# EAGLE design led-er-v2.3b (EAGLE 7.2.0)
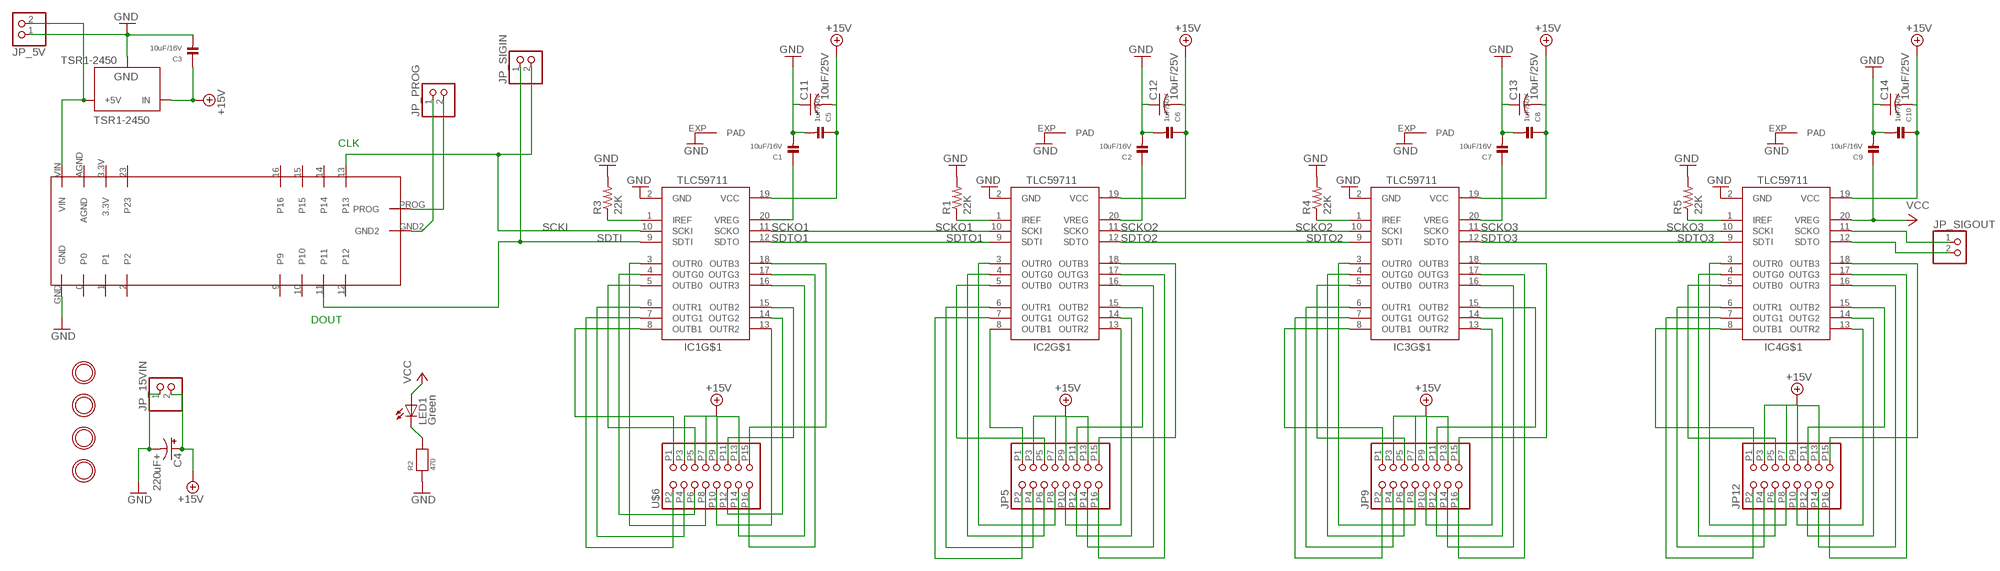
[diagram p0: schematic, sheet 1]

## Parts
C1  10uF/16V  CAP_CERAMIC0805  [0805]
C2  10uF/16V  CAP_CERAMIC0805  [0805]
C3  10uF/16V  CAP_CERAMIC0805  [0805]
C4  220uF+  CPOL-USE5-8.5  [E5-8,5]
C5  1uF/50V  CAP_CERAMIC0805  [0805]
C6  1uF/50V  CAP_CERAMIC0805  [0805]
C7  10uF/16V  CAP_CERAMIC0805  [0805]
C8  1uF/50V  CAP_CERAMIC0805  [0805]
C9  10uF/16V  CAP_CERAMIC0805  [0805]
C10  1uF/50V  CAP_CERAMIC0805  [0805]
C11  10uF/25V  C-USC0805  [C0805]
C12  10uF/25V  C-USC0805  [C0805]
C13  10uF/25V  C-USC0805  [C0805]
C14  10uF/25V  C-USC0805  [C0805]
IC1  TLC59711  [HTSSOP20DAP]
IC2  TLC59711  [HTSSOP20DAP]
IC3  TLC59711  [HTSSOP20DAP]
IC4  TLC59711  [HTSSOP20DAP]
JP5  HEADER-2X8-RIBBON  [2X08_RIBBON]
JP9  HEADER-2X8-RIBBON  [2X08_RIBBON]
JP12  HEADER-2X8-RIBBON  [2X08_RIBBON]
JP_5V  HEADER-1X2  [1X02_OVAL]
JP_15VIN  HEADER-1X2  [1X02_OVAL]
JP_PROG  HEADER-1X2  [1X02_OVAL]
JP_SIGIN  HEADER-1X2  [1X02_OVAL]
JP_SIGOUT  HEADER-1X2  [1X02_OVAL]
LED1  Green  LEDCHIP-LED0805  [CHIP-LED0805]
R1  22K  R-US_FLIPFLOP7  [0805-THM-7]
R2  470  RESISTOR0805  [0805]
R3  22K  R-US_FLIPFLOP7  [0805-THM-7]
R4  22K  R-US_FLIPFLOP7  [0805-THM-7]
R5  22K  R-US_FLIPFLOP7  [0805-THM-7]
TSR1-2450  TSR1-2450  [TSR-1]
U$1  MOUNTINGHOLE  [MOUNTINGHOLE_3.0_PLATED]
U$2  MOUNTINGHOLE  [MOUNTINGHOLE_3.0_PLATED]
U$3  MOUNTINGHOLE  [MOUNTINGHOLE_3.0_PLATED]
U$4  MOUNTINGHOLE  [MOUNTINGHOLE_3.0_PLATED]
U$5  TEENSY_LEDER  [TEENSY_LEDER]
U$6  HEADER-2X8-RIBBON  [2X08_RIBBON]

## Nets
+15V: C3.1 C4.+ C5.1 C6.1 C8.1 C10.1 C11.2 C12.2 C13.2 C14.2 IC1.19(VCC) IC2.19(VCC) IC3.19(VCC) IC4.19(VCC) JP5.P3 JP5.P7 JP5.P9 JP5.P13 JP9.P3 JP9.P7 JP9.P9 JP9.P13 JP12.P3 JP12.P7 JP12.P9 JP12.P13 JP_15VIN.2 TSR1-2450.1(IN) U$6.P3 U$6.P7 U$6.P9 U$6.P13
GND: C1.2 C2.2 C3.2 C4.- C5.2 C6.2 C7.2 C8.2 C9.2 C10.2 C11.1 C12.1 C13.1 C14.1 IC1.2(GND) IC1.EXP(PAD) IC2.2(GND) IC2.EXP(PAD) IC3.2(GND) IC3.EXP(PAD) IC4.2(GND) IC4.EXP(PAD) JP_5V.1 JP_15VIN.1 R1.2 R2.1 R3.2 R4.2 R5.2 TSR1-2450.2(GND) U$5.GND
JP1: JP_5V.2 TSR1-2450.3(+5V) U$5.VIN
N$1: LED1.C R2.2
N$2: IC1.1(IREF) R3.1
N$3: IC1.4(OUTG0) U$6.P6
N$4: IC1.3(OUTR0) U$6.P8
N$5: IC1.14(OUTG2) U$6.P12
N$6: IC1.13(OUTR2) U$6.P10
N$7: IC2.7(OUTG1) JP5.P2
N$8: IC2.6(OUTR1) JP5.P4
N$9: IC2.5(OUTB0) JP5.P5
N$10: IC2.4(OUTG0) JP5.P6
N$11: IC1.15(OUTB2) U$6.P11
N$12: IC1.16(OUTR3) U$6.P14
N$13: IC1.17(OUTG3) U$6.P16
N$14: IC1.18(OUTB3) U$6.P15
N$15: IC2.1(IREF) R1.1
N$16: IC3.8(OUTB1) JP9.P1
N$17: IC2.13(OUTR2) JP5.P10
N$18: IC3.4(OUTG0) JP9.P6
N$19: IC4.7(OUTG1) JP12.P2
N$20: IC3.7(OUTG1) JP9.P2
N$21: IC4.6(OUTR1) JP12.P4
N$22: IC3.6(OUTR1) JP9.P4
N$23: IC2.14(OUTG2) JP5.P12
N$24: IC2.15(OUTB2) JP5.P11
N$25: IC2.16(OUTR3) JP5.P14
N$26: IC2.17(OUTG3) JP5.P16
N$27: IC2.18(OUTB3) JP5.P15
N$28: IC3.1(IREF) R4.1
N$29: IC3.14(OUTG2) JP9.P12
N$30: IC2.8(OUTB1) JP5.P1
N$31: IC3.13(OUTR2) JP9.P10
N$37: IC3.15(OUTB2) JP9.P11
N$38: IC3.16(OUTR3) JP9.P14
N$39: IC3.17(OUTG3) JP9.P16
N$40: IC3.18(OUTB3) JP9.P15
N$41: IC4.1(IREF) R5.1
N$42: IC2.3(OUTR0) JP5.P8
N$43: IC4.13(OUTR2) JP12.P10
N$44: IC3.5(OUTB0) JP9.P5
N$45: IC1.6(OUTR1) U$6.P4
N$46: IC1.5(OUTB0) U$6.P5
N$47: IC1.7(OUTG1) U$6.P2
N$48: IC1.8(OUTB1) U$6.P1
N$49: IC4.14(OUTG2) JP12.P12
N$50: IC4.15(OUTB2) JP12.P11
N$51: IC4.16(OUTR3) JP12.P14
N$52: IC4.17(OUTG3) JP12.P16
N$53: IC4.18(OUTB3) JP12.P15
N$54: JP_PROG.1 U$5.GND2
N$55: JP_PROG.2 U$5.PROG
N$56: C1.1 IC1.20(VREG)
N$57: C7.1 IC3.20(VREG)
N$58: C2.1 IC2.20(VREG)
N$59: IC4.11(SCKO) JP_SIGOUT.1
N$60: IC4.12(SDTO) JP_SIGOUT.2
N$61: IC3.3(OUTR0) JP9.P8
N$62: IC4.3(OUTR0) JP12.P8
N$71: IC4.4(OUTG0) JP12.P6
N$79: IC4.5(OUTB0) JP12.P5
N$80: IC4.8(OUTB1) JP12.P1
SCKI: IC1.10(SCKI) JP_SIGIN.2 U$5.13
SCKO1: IC1.11(SCKO) IC2.10(SCKI)
SCKO2: IC2.11(SCKO) IC3.10(SCKI)
SCKO3: IC3.11(SCKO) IC4.10(SCKI)
SDTI: IC1.9(SDTI) JP_SIGIN.1 U$5.11
SDTO1: IC1.12(SDTO) IC2.9(SDTI)
SDTO2: IC2.12(SDTO) IC3.9(SDTI)
SDTO3: IC3.12(SDTO) IC4.9(SDTI)
VCC: C9.1 IC4.20(VREG) LED1.A
Unconnected: U$5.0 U$5.1 U$5.2 U$5.3.3V U$5.9 U$5.10 U$5.12 U$5.14 U$5.15 U$5.16 U$5.23 U$5.AGND

## Notes on the sheet
- CLK
- DOUT

## Library data of the parts
C1-C3 C5-C10 = microbuilder:CAP_CERAMIC: Ceramic Capacitors 0402 - 0402 Surface Mount Capacitors 16pF 50V 5% [Digikey: 445-4899-2-ND] 18pF 50V 5% [Digikey: 490-1281-2-ND] 22pF 50V 5% [Digikey: 490-1283-2-ND] 68pF 50V 5% [Digikey: 490-1289-2-ND] 0.1uF 10V 10% [Digikey: 490-1318-2-ND] 1.0uF 6.3V 10% [Digikey: 490-1320-2-ND] 0603 - 0603 Surface Mount Capacitors 16 pF 50V 5% [Digikey: 445-5051-2-ND] 22 pF 50V [Digikey: PCC220ACVTR-ND] 33 pF 50V 5% [Digikey: 490-1415-1-ND] 56pF 50V 5% [Digikey: 490-1421-1-ND] 220pF 50V 5% [Digikey: 445-1285-1-ND] 680 pF 50V 2200 pF 50V 5% C0G [Digikey: 445-1297-1-ND] 5600 pF 100V 5% X7R [Digikey: 478-3711-1-ND] 0.1 µF 25V 10% [Digikey: PCC2277TR-ND] 0.22 µF 16V 10% X7R [Digikey: 445-1318-1-ND] 1.0 µF 25V 10% [Digikey: 445-5146-2-ND] 0603 - RF Specific 3pF 250V +/-0.1pF RF [Digikey: 712-1347-1-ND] 18 pF 250V 5% [Digikey: 478-3505-1-ND or 712-1322-1-ND] 56 pF 250V 5% C0G RF [Digikey: 490-4867-1-ND] 68 pF 250V RF [Digikey: 490-4868-1-ND] 0805 - 0805 Surface Mount Capacitors 220 pF 250V 2% RF Ceramic Capacitor [Digikey: 712-1398-1-ND] 1000 pF 50V 2% NP0 Ceramic Capacitor [Digikey: 478-3760-1-ND] 0.1 µF 25V 10% Ceramic Capacitor [Digikey: PCC1828TR-ND] 1.0 µF 16V 10% Ceramic Capacitor[Digikey: 490-1691-2-ND] 10.0 µF 10V 10% Ceramic Capacitor[Digikey: 709-1228-1-ND] 10.0 uF 16V 10% Ceramic Capacitor [Digikey: 478-5165-2-ND] 47 uF 6.3V 20% Ceramic Capacitor [Digikey: 587-1779-1-ND or 399-5506-1-ND] 1206 - 1206 Surface Mount Capacitors 47uF 10V 20% Ceramic Capacitor [Digikey: 490-5528-1-ND or 399-5508-1-ND or 445-6010-1-ND] 100uF 6.3V -20%, +80% Y5V Ceramic Capacitor (Digikey: 490-4512-1-ND, Mouser: 81-GRM31CF50J107ZE1L)
C4 = adafruit:CPOL-US: POLARIZED CAPACITOR, American symbol
C11-C14 = adafruit:C-US: CAPACITOR, American symbol
IC1-IC4 = adafruit:TLC59711
JP5 JP9 JP12 U$6 = Andrews:HEADER-2X8-RIBBON
JP_5V JP_15VIN JP_PROG JP_SIGIN JP_SIGOUT = microbuilder:HEADER-1X2: PIN HEADER
LED1 = adafruit:LED: LED OSRAM: - CHIPLED LG R971, LG N971, LY N971, LG Q971, LY Q971, LO R971, LY R971 LH N974, LH R974 LS Q976, LO Q976, LY Q976 LO Q996 - Hyper CHIPLED LW Q18S LB Q993, LB Q99A, LB R99A - SideLED LS A670, LO A670, LY A670, LG A670, LP A670 LB A673, LV A673, LT A673, LW A673 LH A674 LY A675 LS A676, LA A676, LO A676, LY A676, LW A676 LS A679, LY A679, LG A679 - Hyper Micro SIDELED® LS Y876, LA Y876, LO Y876, LY Y876 LT Y87S - SmartLED LW L88C, LW L88S LB L89C, LB L89S, LG L890 LS L89K, LO L89K, LY L89K LS L896, LA L896, LO L896, LY L896 - TOPLED LS T670, LO T670, LY T670, LG T670, LP T670 LSG T670, LSP T670, LSY T670, LOP T670, LYG T670 LG T671, LOG T671, LSG T671 LB T673, LV T673, LT T673, LW T673 LH T674 LS T676, LA T676, LO T676, LY T676, LB T676, LH T676, LSB T676, LW T676 LB T67C, LV T67C, LT T67C, LS T67K, LO T67K, LY T67K, LW E67C LS E67B, LA E67B, LO E67B, LY E67B, LB E67C, LV E67C, LT E67C LW T67C LS T679, LY T679, LG T679 LS T770, LO T770, LY T770, LG T770, LP T770 LB T773, LV T773, LT T773, LW T773 LH T774 LS E675, LA E675, LY E675, LS T675 LS T776, LA T776, LO T776, LY T776, LB T776 LHGB T686 LT T68C, LB T68C - Hyper Mini TOPLED® LB M676 - Mini TOPLED Santana® LG M470 LS M47K, LO M47K, LY M47K Source: http://www.osram.convergy.de/
R1 R3-R5 = adafruit:R-US_: RESISTOR, American symbol
R2 = microbuilder:RESISTOR: Resistors 0402 - 0402 Surface Mount Package 22 Ohm 1% 1/16W [Digikey: 311-22.0LRTR-ND] 33 Ohm 5% 1/16W 1.0K 5% 1/16W 1.5K 5% 1/16W 2.0K 1% 1/16W 10.0K 1% 1/16W [Digikey: 311-10.0KLRTR-ND] 10.0K 5% 1/16W [Digikey: RMCF0402JT10K0TR-ND] 12.1K 1% 1/16W [Digikey: 311-22.0LRTR-ND] 100.0K 5% 1/16W 0603 - 0603 Surface Mount Package 0 Ohm 1/10 Watt 1% Resistor 15 Ohm 1/10 Watt 1% Resistor 33 Ohm 1/10 Watt 1% Resistor 49.9 Ohm 1/10 Watt 1% Resistor 100 Ohm 1/10 Watt 1% Resistor 150 Ohm 1/10 Watt 1% Resistor 240 Ohm 1/10 Watt 1% Resistor 390 Ohm 1/10 Watt 1% Resistor 560 Ohm 1/10 Watt 1% Resistor 680 Ohm 1/10 Watt 1% Resistor 750 Ohm 1/10 Watt 1% Resistor 1.0K Ohm 1/10 Watt 1% Resistor 1.5K Ohm 1/10 Watt 1% Resistor 2.0K Ohm 1/10 Watt 1% Resistor 2.2K Ohm 1/10 Watt 1% Resistor 3.3K Ohm 1/10 Watt 1% Resistor 4.7K Ohm 1/10 Watt 1% Resistor 10.0K Ohm 1/10 Watt 1% Resistor 12.0K Ohm 1/10 Watt 1% Resistor 12.1K Ohm 1/10 Watt 1% Resistor 20.0K Ohm 1/10 Watt 1% Resistor 33.0K Ohm 1/10 Watt 1% Resistor 100.0K Ohm 1/10 Watt 1% Resistor 0805 - 0805 Surface Mount Package 0 Ohm 1/8 Watt 1% Resistor 33 Ohm 1/8 Watt 1% Resistor 100 Ohm 1/8 Watt 1% Resistor 150 Ohm 1/8 Watt 1% Resistor 200 Ohm 1/8 Watt 1% Resistor 240 Ohm 1/8 Watt 1% Resistor 330 Ohm 1/8 Watt 1% Resistor 390 Ohm 1/8 Watt 1% Resistor 470 Ohm 1/8 Watt 1% Resistor 1.0K Ohm 1/8 Watt 1% Resistor 1.5K Ohm 1/8 Watt 1% Resistor 2.0K Ohm 1/8 Watt 1% Resistor 4.7K Ohm 1/8 Watt 1% Resistor 5.1K Ohm 1/8 Watt 1% Resistor 5.6K Ohm 1/8 Watt 1% Resistor 10.0K Ohm 1/8 Watt 1% Resistor 22.0K Ohm 1/8 Watt 1% Resistor 33.0K Ohm 1/8 Watt 1% Resistor 100K Ohm 1/8 Watt 1% Resistor 1206 - 1206 Surface Mount Package 2012 - 2010 Surface Mount Package 0.11 Ohm 1/2 Watt 1% Resistor - Digikey: RHM.11UCT-ND
TSR1-2450 = SteelCaveRobotics-Power:TSR1-2450: Traco Power TSR 1-2450 5.0v switching regulator
U$1-U$4 = microbuilder:MOUNTINGHOLE: Mounting Hole For #2 screws (0.086"/2.18mm width, 0.094"/2.4mm hole) use 2.5mm
U$5 = Andrews:TEENSY_LEDER

## Board
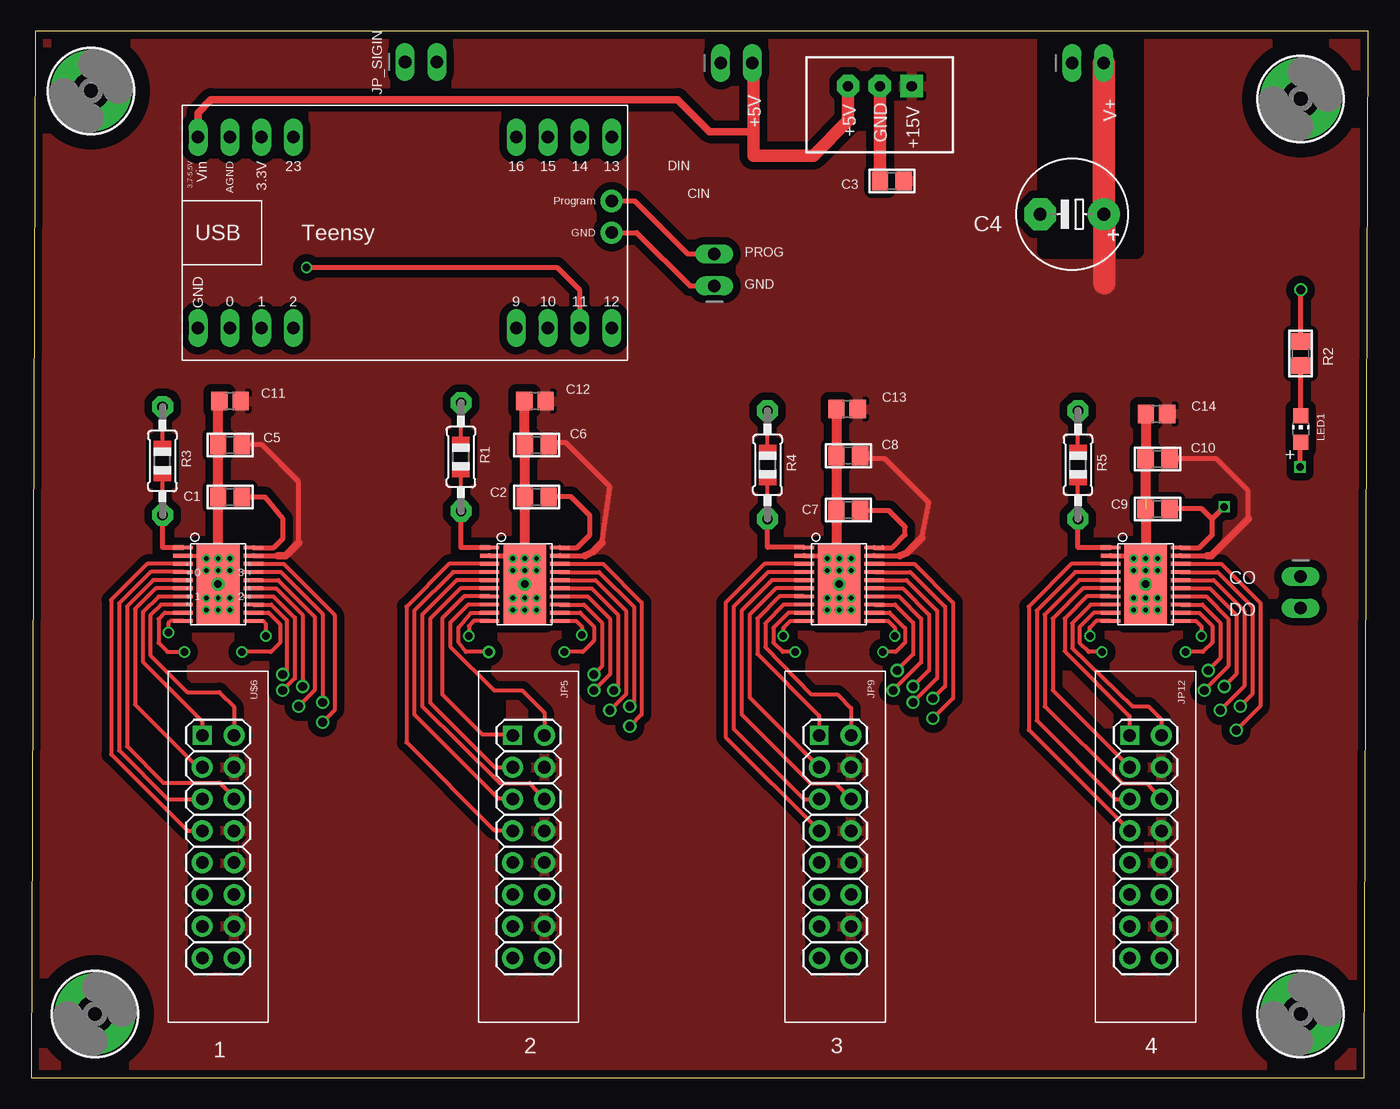
[diagram p1: board, top side]
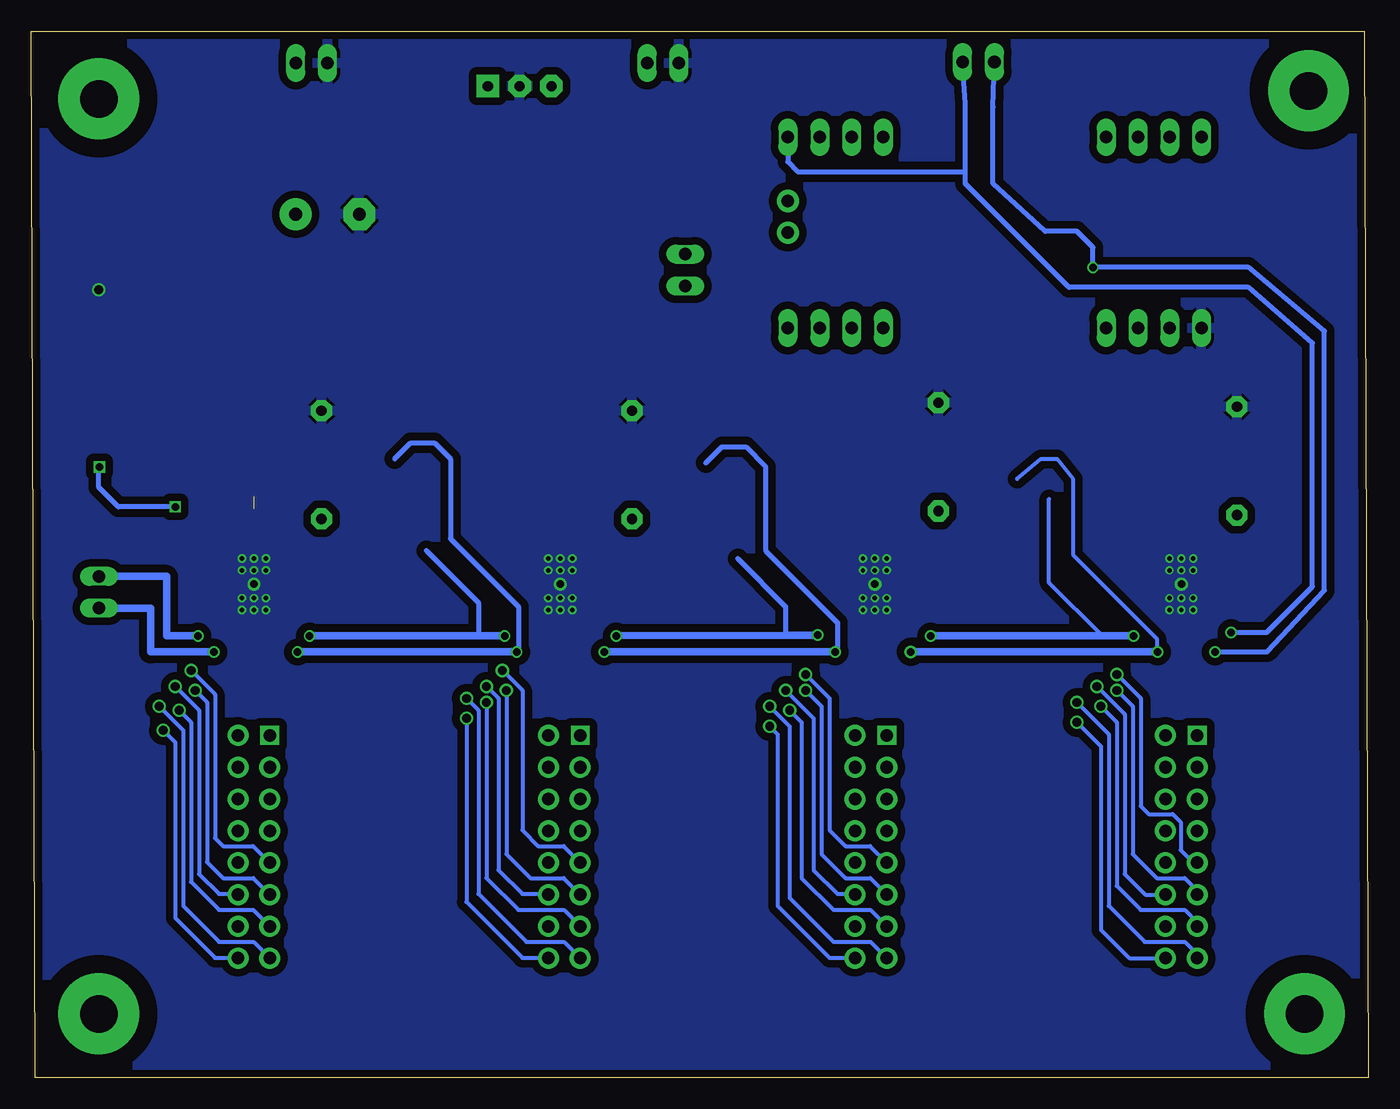
[diagram p2: board, bottom side, seen from below]

Size 106.72 x 83.49 mm. Coordinates in mm from the lower left corner, seen from the top.
Outline: 0,0 106.41,0 106.72,83.49 0.32,83.49 0,0
Copper layers (1*16): Top 0.035mm / dielectric 1.5mm / Bottom 0.035mm
Design rules "SeeedStudio_2layer_DRU_no_angle_20140221 *": minimum track width 6mil, minimum drill 12mil, track to track 6mil, track to pad 6mil, pad to pad 6mil, via to via 6mil, smd to smd 0mil, copper to edge 10mil, drill to drill 10mil, minimum pad ring 10mil, minimum via ring 6mil, stop-mask expansion 2mil, vias tented up to drill 100mil, thermal gap 10mil
tRestrict: area 13,36.6 to 13.6,37.7; area 7.6,25.2 to 11.8,32.5; area 57.3,28.3 to 61.2,33.1; area 80.9,69.4 to 88.2,82.5; area 15.3,42.7 to 19.4,45.5; area 40.1,43 to 44,45.5; area 65.9,43 to 69.1,44.3; area 90.1,43 to 93.6,44.6; area 80.9,65.9 to 88.2,72.3; area 14,18.1 to 15.9,18.7; area 15.6,15.6 to 16.6,15.9; area 15.6,20.7 to 16.6,21; 7 more areas

### Footprints (pad centres in the part's own frame; a part is rotated, then mirrored left to right if it is on the bottom)
0805 = smd 1.3 x 1.5: 1 -0.95,0; 2 0.95,0
E5-8,5 = drill 1.016 pad 2.54: + -2.54,0 | drill 1.016 pad 2.54 octagon: - 2.54,0
C0805 = smd 1.3 x 1.5: 1 -0.85,0; 2 0.85,0
HTSSOP20DAP = smd 0.3 x 1.55: 1 -2.925,-2.8; 2 -2.275,-2.8; 3 -1.625,-2.8; 4 -0.975,-2.8; 5 -0.325,-2.8; 6 0.325,-2.8; 7 0.975,-2.8; 8 1.625,-2.8; 9 2.275,-2.8; 10 2.925,-2.8; 11 2.925,2.8; 12 2.275,2.8; 13 1.625,2.8; 14 0.975,2.8; 15 0.325,2.8; 16 -0.325,2.8; 17 -0.975,2.8; 18 -1.625,2.8; 19 -2.275,2.8; 20 -2.925,2.8 | smd 6.5 x 3.4: EXP 0,0
2X08_RIBBON = drill 1 pad 1.676: P1 -8.89,1.27; P3 -6.35,1.27; P4 -6.35,-1.27; P5 -3.81,1.27; P6 -3.81,-1.27; P7 -1.27,1.27; P8 -1.27,-1.27; P9 1.27,1.27; P10 1.27,-1.27; P11 3.81,1.27; P12 3.81,-1.27; P13 6.35,1.27; P14 6.35,-1.27; P15 8.89,1.27; P16 8.89,-1.27 | drill 1 square: P2 -8.89,-1.27
1X02_OVAL = drill 1 long: 1 -1.27,0; 2 1.27,0
CHIP-LED0805 = smd 1.2 x 1.2: A 0,-1.05; C 0,1.05
0805-THM-7 = drill 0.813 pad 1.676 octagon: 1 -4.318,0; 2 4.318,0
TSR-1 = drill 0.8 pad 1.8 square: 1 -2.54,-1.5 | drill 0.8 pad 1.8 octagon: 2 0,-1.5; 3 2.54,-1.5
MOUNTINGHOLE_3.0_PLATED = drill 3 pad 6.452: P$1 0,0
TEENSY_LEDER = drill 1 pad 1.422 long: 0 12.7,7.62; 1 10.16,7.62; 2 7.62,7.62; 3.3V 10.16,-7.62; 9 -10.16,7.62; 10 -12.7,7.62; 11 -15.24,7.62; 12 -17.78,7.62; 13 -17.78,-7.62; 14 -15.24,-7.62; 15 -12.7,-7.62; 16 -10.16,-7.62; 23 7.62,-7.62; AGND 12.7,-7.62; GND 15.24,7.62; VIN 15.24,-7.62 | drill 1 pad 1.778: GND2 -17.78,0; PROG -17.78,-2.54

### Placement (x,y rotation side)
C1  15.87,46.33 180 top
C2  40.34,46.33 180 top
C3  68.69,71.55 180 top
C4  83.08,68.89 180 top
C5  15.87,50.5 180 top
C6  40.34,50.5 180 top
C7  65.23,45.28 180 top
C8  65.22,49.62 180 top
C9  89.91,45.38 180 top
C10  89.91,49.38 180 top
C11  15.87,53.99 0 top
C12  40.21,53.99 0 top
C13  65.12,53.35 0 top
C14  89.82,52.96 0 top
IC1  14.92,39.37 270 top
IC2  39.38,39.37 270 top
IC3  64.49,39.37 270 top
IC4  88.96,39.37 270 top
JP5  39.7,18.41 270 top
JP9  64.17,18.41 270 top
JP12  88.96,18.41 270 top
JP_5V  56.29,80.96 0 top
JP_15VIN  84.35,80.96 0 top
JP_PROG  54.53,64.45 90 top
JP_SIGIN  31.11,81.06 0 top
JP_SIGOUT  101.33,38.73 270 top
LED1  101.34,51.75 0 top
R1  34.3,49.53 90 top
R2  101.34,57.78 270 top
R3  10.47,49.21 90 top
R4  58.77,48.89 90 top
R5  83.56,48.89 90 top
TSR1-2450  67.74,77.63 180 top
U$1  101.34,78.11 0 top
U$2  5.08,5.08 0 top
U$3  101.34,5.08 0 top
U$4  4.76,78.74 0 top
U$5  28.54,67.42 180 top
U$6  14.92,18.41 270 top

### Tracks (layer width: path | path; a pad name or v marks a point on that pad's centre or on a via)
+15V
  Top 0.406: IC1.19 19.67,41.65 | 21.34,42.68 21.34,47.56 18.41,50.49 C5.1 | IC2.19 44.19,41.65 | 45.55,42.68 46.19,47.14 42.68,50.64 41.43,50.64 C6.1 | IC3.19 69.36,41.65 | 70.73,42.67 71.11,43.07 71.67,45.87 68.16,49.37 66.23,49.37 C8.1 | IC4.19 93.88,41.65 | 97.15,44.59 97.15,46.82 94.6,49.37 C10.1
  Top 0.61: 19.67,41.65 20.3,41.65 21.34,42.68 | 44.19,41.65 44.83,41.96 45.55,42.68 | 69.36,41.65 69.91,41.87 71.11,43.07 | 93.88,41.65 94.2,41.65 97.15,44.59
  Top 1.27: C4.+ 85.68,68.89
  Top 1.778: JP_15VIN.2 C4.+ | 85.68,68.89 85.68,63.38
  pour Top (isolate 0.61, rank 2): 0.32,83.19 0,0 106.42,0.32 106.74,83.5
GND  (via drill 0.36, 0.6 pad 1.02, 0.7)  (1 unrouted)
  Top 0.305: 38.06,41.65 v38.43,41.43 | IC1.2 13.96,41.65 v13.96,41.43
  Top 0.406: IC2.2 38.06,41.65 | R2.1 v101.34,62.87 | IC3.2 63.54,41.65 v63.54,41.43 | IC4.2 88.01,41.65 v88.01,41.43 | v39.39,41.44 v39.38,41.43
  Top 0.61: 14.91,46.01 C1.2 | 14.92,53.89 C11.1 | 10.93,53.99 R3.2 | 34.44,53.99 R1.2 | 39.33,50.6 C6.2
  Top 0.813: v14.91,41.43 14.91,46.01 | C1.2 C5.2 14.92,53.89 | C12.1 39.33,50.6 | C6.2 C2.2 v39.39,41.44 | C13.1 64.27,49.31 C8.2 C7.2 64.28,41.64 v64.49,41.43 | 88.96,46.35 v88.96,41.43 | C9.2 C10.2 88.97,49.39 C14.1
  Top 1.016: TSR1-2450.2 C3.2
  Top 1.27: 10.47,53.66 R3.2 | 58.77,53.34 R4.2 | 83.56,53.34 R5.2
  other vias: 88.96,39.37 89.91,37.31 88.96,37.31 88.01,37.31 89.91,38.26 88.96,38.26 88.01,38.26 89.91,40.48 88.96,40.48 88.01,40.48 64.49,39.37 65.44,38.26 64.49,38.26 63.54,38.26 65.44,37.31 64.49,37.31 63.54,37.31 65.44,40.48 64.49,40.48 63.54,40.48 39.38,39.37 38.43,38.26 39.38,38.26 40.34,38.26 40.34,40.48 39.38,40.48 38.43,40.48 38.43,37.31 39.38,37.31 40.34,37.31 14.92,39.37 15.87,40.48 14.92,40.48 13.96,40.48 15.87,41.43 15.87,38.26 14.92,38.26 13.96,38.26 13.96,37.31 14.92,37.31 15.87,37.31 40.34,41.43 65.44,41.43 89.91,41.43
  pour Bottom (isolate 0.61, rank 2): 0,83.19 0,0 106.42,0.32 106.42,83.5
JP1
  Top 0.61: U$5.VIN 13.3,77 14.33,78.04 51.6,78.04 54.15,75.49 57.65,75.49
  Top 1.016: JP_5V.2 57.65,80.87 57.65,75.49 57.65,73.58 62.43,73.58 65.2,76.35 TSR1-2450.3
N$1
  Top 0.406: LED1.C R2.2
N$2
  Top 0.406: IC1.1 10.47,42.3 R3.1
N$3
  Top 0.305: IC1.4 9.52,40.35 7.01,37.83 7.01,26.12 10.9,22.23 U$6.P6
N$4
  Top 0.305: IC1.3 9.25,41 6.37,38.11 6.37,25.8 12.48,19.68 U$6.P8
N$5  (via drill 0.7)
  Top 0.305: IC1.14 19.32,38.4 21.02,36.7 | 21.02,36.7 | 21.02,36.7 21.02,31.85 v20.07,30.9
  Bottom 0.305: U$6.P12 13.64,14.92 14.65,15.93 16.88,15.93 18.79,17.84 18.79,29.62 v20.07,30.9
N$6  (via drill 0.7)
  Top 0.305: IC1.13 19.15,37.75 20.39,36.51 | 20.39,36.51 | 20.39,36.51 20.39,32.49 v20.07,32.17
  Bottom 0.305: v20.07,32.17 18.16,30.26 18.16,21.66 17.52,21.02 15.61,21.02 14.97,20.39 14.97,18.16 13.96,17.14 U$6.P10
N$7
  Top 0.305: IC2.7 34.55,38.39 32.81,36.65 32.81,30.58 35.99,27.39 38.34,27.39 JP5.P2
N$8
  Top 0.305: IC2.6 34.27,39.05 31.85,36.63 31.85,29.9 36.99,24.76 JP5.P4
N$9
  Top 0.305: IC2.5 33.96,39.7 31.21,36.95 31.21,29.62 37.43,23.51 39.79,23.51 JP5.P5
N$10
  Top 0.305: IC2.4 33.66,40.34 30.58,37.27 30.58,28.98 37.27,22.3 38.36,22.3 JP5.P6
N$11  (via drill 0.7)
  Top 0.305: IC1.15 19.56,39.05 21.66,36.95 v21.66,31.21
  Bottom 0.305: U$6.P11 17.79,14.61 19.43,16.24 19.43,28.98 v21.66,31.21
N$12  (via drill 0.7)
  Top 0.305: IC1.16 19.71,39.69 22.61,36.79 22.61,30.9 v21.34,29.62
  Bottom 0.305: U$6.P14 13.64,12.37 14.65,13.38 18.16,13.38 20.07,15.29 20.07,28.35 v21.34,29.62
N$13  (via drill 0.7)
  Top 0.305: IC1.17 19.91,40.35 23.25,37.01 v23.25,29.94
  Bottom 0.305: U$6.P16 13.64,9.82 14.65,10.83 17.84,10.83 20.7,13.7 20.7,27.39 v23.25,29.94
N$14  (via drill 0.7)
  Top 0.305: IC1.18 20.15,40.99 24.21,36.93 24.21,29.3 v23.25,28.35 | v23.25,28.35
  Bottom 0.305: U$6.P15 19.08,9.53 21.34,11.79 21.34,26.44 v23.25,28.35
N$15
  Top 0.406: IC2.1 34.3,42.3 R1.1
N$16
  Top 0.305: IC3.8 60.05,37.74 58.6,36.25 58.6,34.35 62.23,30.59 64.34,30.58 65.44,29.48 JP9.P1
N$17  (via drill 0.7)
  Top 0.305: IC2.13 44.11,37.74 45.55,36.31 45.55,32.81 v44.91,32.17
  Bottom 0.305: v44.91,32.17 43,30.26 43,19.75 41.73,18.47 39.76,18.47 JP5.P10
N$18
  Top 0.305: IC3.4 58.82,40.34 56.06,37.59 56.06,27.83 61.68,22.21 62.89,22.21 JP9.P6
N$19
  Top 0.305: IC4.7 84.26,38.4 82.5,36.63 82.5,34.03 87.67,28.85 87.67,27.32 JP12.P2
N$20
  Top 0.305: IC3.7 59.74,38.4 57.97,36.63 57.97,33.8 62.9,28.88 JP9.P2
N$21
  Top 0.305: IC4.6 83.96,39.05 81.54,36.63 81.54,30.91 JP12.P4
N$22
  Top 0.305: IC3.6 59.43,39.05 57.33,36.95 57.33,30.33 JP9.P4
N$23  (via drill 0.7)
  Top 0.305: IC2.14 44.42,38.4 46.19,36.63 46.19,32.17 v44.91,30.9
  Bottom 0.305: v44.91,30.9 43.64,29.62 43.64,17.84 41.73,15.93 39.75,15.93 JP5.P12
N$24  (via drill 0.7)
  Top 0.305: IC2.15 44.73,39.05 46.82,36.95 46.82,31.21 v46.5,30.9
  Bottom 0.305: v46.5,30.9 44.27,28.67 44.27,16.56 42.36,14.65 41.02,14.65 JP5.P11
N$25  (via drill 0.7)
  Top 0.305: IC2.16 45.03,39.7 47.46,37.27 47.46,30.58 v46.19,29.3
  Bottom 0.305: v46.19,29.3 45.23,28.35 45.23,15.93 42.68,13.38 39.74,13.38 JP5.P14
N$26  (via drill 0.7)
  Top 0.305: IC2.17 45.34,40.34 48.1,37.59 48.1,29.94 v47.78,29.62
  Bottom 0.305: v47.78,29.62 | v47.78,29.62 46.19,28.03 46.19,14.33 42.68,10.83 39.73,10.83 JP5.P16
N$27  (via drill 0.7)
  Top 0.305: IC2.18 45.64,40.99 48.73,37.9 48.73,28.98 v47.78,28.03
  Bottom 0.305: v47.78,28.03 | v47.78,28.03 47.14,27.39 47.14,13.7 43,9.55 41,9.55 JP5.P15
N$28
  Top 0.305: IC3.1 61.67,42.31
  Top 0.406: 61.67,42.31 58.77,42.31 R4.1
N$29  (via drill 0.7)
  Top 0.305: IC3.14 69.26,38.4 71.03,36.63 71.03,33.13 v68.8,30.9
  Bottom 0.305: v68.8,30.9 68.8,17.84 66.89,15.93 64.22,15.93 JP9.P12
N$30
  Top 0.305: IC2.8 34.87,37.74 33.44,36.31 33.44,34.4 36.95,30.9 39.18,30.9 40.97,29.1 JP5.P1
N$31  (via drill 0.7)
  Top 0.305: IC3.13 68.96,37.74 70.39,36.31 70.39,33.76 v69.12,32.49
  Bottom 0.305: v69.12,32.49 | v69.12,32.49 67.53,30.9 67.53,19.75 66.25,18.47 64.23,18.47 JP9.P10
N$37  (via drill 0.7)
  Top 0.305: IC3.15 69.57,39.05 71.67,36.95 71.67,32.49 v70.39,31.21
  Bottom 0.305: v70.39,31.21 69.44,30.26 69.44,16.56 67.53,14.65 65.49,14.65 JP9.P11
N$38  (via drill 0.7)
  Top 0.305: IC3.16 69.88,39.7 72.3,37.27 72.3,31.85 v70.39,29.94
  Bottom 0.305: v70.39,29.94 70.39,15.93 67.84,13.38 64.21,13.38 JP9.P14
N$39  (via drill 0.7)
  Top 0.305: IC3.17 70.18,40.34 72.94,37.59 72.94,31.21 v71.98,30.26
  Bottom 0.305: v71.98,30.26 71.03,29.3 71.03,14.65 67.21,10.83 64.21,10.83 JP9.P16
N$40  (via drill 0.7)
  Top 0.305: IC3.18 70.49,40.99 73.58,37.9 73.58,30.26 v71.98,28.67
  Bottom 0.305: v71.98,28.67 71.98,14.02 67.53,9.55 65.47,9.55 JP9.P15
N$41
  Top 0.406: IC4.1 83.56,42.3 R5.1
N$42
  Top 0.305: IC2.3 33.35,40.99 29.94,37.59 29.94,26.75 36.95,19.75 38.37,19.75 JP5.P8
N$43  (via drill 0.7)
  Top 0.305: IC4.13 93.48,37.74 94.92,36.31 94.92,33.44 v93.96,32.49
  Bottom 0.305: v93.96,32.49 92.05,30.58 92.05,19.11 91.41,18.47 89.02,18.47 JP12.P10
N$44
  Top 0.305: IC3.5 59.12,39.7 58.92,39.5 | 58.92,39.5 | 58.92,39.5 56.7,37.27 56.7,28.98 62.22,23.48 64.2,23.48 JP9.P5
N$45
  Top 0.305: IC1.6 9.94,39.05 8.28,37.4 8.28,29.77 13.29,24.77 U$6.P4
N$46
  Top 0.305: IC1.5 9.72,39.69 7.64,37.61 7.64,26.44 10.54,23.55 15.05,23.55 16.18,22.41 U$6.P5
N$47
  Top 0.305: IC1.7 10.16,38.39 8.91,37.14 8.91,33.18 13.64,28.45 U$6.P2
N$48
  Top 0.305: IC1.8 10.36,37.75 9.51,36.9 9.51,33.71 12.46,30.76 15.01,30.76 16.18,29.58 U$6.P1
N$49  (via drill 0.7)
  Top 0.305: IC4.14 93.79,38.4 95.56,36.63 95.56,32.81 v93.64,30.9
  Bottom 0.305: v93.64,30.9 | v93.64,30.9 92.69,29.94 92.69,17.2 91.41,15.93 89.01,15.93 JP12.P12
N$50  (via drill 0.7)
  Top 0.305: IC4.15 94.09,39.05 96.19,36.95 96.19,32.17 v95.24,31.21
  Bottom 0.305: v95.24,31.21 93.33,29.3 93.33,16.24 91.73,14.65 90.28,14.65 JP12.P11
N$51  (via drill 0.7)
  Top 0.305: IC4.16 94.4,39.7 96.83,37.27 96.83,31.21 v94.92,29.3
  Bottom 0.305: v94.92,29.3 | v94.92,29.3 93.96,28.35 93.96,15.61 91.73,13.38 89,13.38 JP12.P14
N$52  (via drill 0.7)
  Top 0.305: IC4.17 94.71,40.34 97.47,37.59 97.47,30.58 v96.51,29.62
  Bottom 0.305: v96.51,29.62 | v96.51,29.62 94.6,27.71 94.6,13.7 91.73,10.83 88.99,10.83 JP12.P16
N$53  (via drill 0.7)
  Top 0.305: IC4.18 95.01,40.99 98.1,37.9 98.1,29.62 v96.19,27.71
  Bottom 0.305: v96.19,27.71 95.24,26.75 95.24,12.74 92.05,9.55 90.26,9.55 JP12.P15
N$54
  Top 0.406: U$5.GND2 48.33,67.42 52.57,63.19 JP_PROG.1
N$55
  Top 0.406: U$5.PROG 48.17,69.96 52.39,65.74 54.51,65.74 JP_PROG.2
N$56
  Top 0.406: C1.1 18.65,46.33 20.07,44.59 20.07,43 19.36,42.3 IC1.20
N$57
  Top 0.406: 67.98,42.3 IC3.20 68.73,42.3 69.75,43.32 69.75,43.95 68.48,45.23 66.23,45.23 C7.1
N$58
  Top 0.406: IC2.20 43.57,42.3 44.59,43.32 44.59,44.84 43.09,46.34 41.3,46.34 C2.1
N$59  (via drill 0.6)
  Top 0.305: IC4.11 | IC4.11 92.97,36.45 93.41,36 v93.41,35.24
  Bottom 0.61: v93.41,35.24 95.93,35.24 95.93,40.01 JP_SIGOUT.1
N$60  (via drill 0.6)
  Top 0.305: IC4.12 93.25,37.09 94.28,36.06 94.28,34.72 93.53,33.97 v92.14,33.97
  Bottom 0.61: v92.14,33.97 97.2,33.97 97.2,37.47 JP_SIGOUT.2
N$61
  Top 0.305: IC3.3 58.51,40.99 55.42,37.9 55.42,27.16 JP9.P8
N$62
  Top 0.305: IC4.3 83.04,40.99 79.63,37.59 79.63,27.75 JP12.P8
N$71
  Top 0.305: IC4.4 83.34,40.34 80.27,37.27 80.27,28.5 86.56,22.21 87.67,22.21 JP12.P6
N$79
  Top 0.305: IC4.5 83.65,39.7 80.9,36.95 80.9,29.62 87.11,23.48 89.04,23.48 JP12.P5
N$80
  Top 0.305: IC4.8 84.57,37.74 83.09,36.25 83.11,34.27 87.91,29.62 89.18,29.62 90.23,28.58 JP12.P1
SCKI  (via drill 0.6)
  Top 0.305: IC1.10 11.11,36.45 10.95,36.28 v10.95,35.54 v10.94,35.53
  Bottom 0.406: v10.94,35.53 8.11,35.53 4.46,39.18 4.46,58.61 9.55,63.07 23.89,63.07 32.17,71.35 32.17,72.3 | 32.17,72.3 32.17,77.77 JP_SIGIN.2 | U$5.13 46.32,73.08 45.55,72.3 32.17,72.3
SCKO1  (via drill 0.6)
  Top 0.305: IC1.11 18.49,36.44 18.72,36.21 v18.72,35.24 | IC2.10 36.54,36.45 35.31,36.45 34.93,36.02 v34.93,35.24 | v34.93,35.24
  Bottom 0.305: v18.72,35.24 21.23,35.24 25.48,39.5 25.48,46.18
  Bottom 0.61: v18.72,35.24 v34.93,35.24
SCKO2  (via drill 0.6)
  Top 0.305: v60.04,35.24 60.05,35.88 60.61,36.45 IC3.10 | IC2.11 43.5,36.45 43.95,35.99 43.95,35.38 v43.96,35.31
  Bottom 0.406: 50.33,41.41 46.5,37.59 46.5,35.3
  Bottom 0.61: v43.96,35.31 46.5,35.3 v60.04,35.24
SCKO3  (via drill 0.6)
  Top 0.305: IC3.11 67.35,36.45 68.4,36.45 68.94,35.91 v68.94,35.24 | v84.51,35.24 84.49,35.89 84.49,35.91 85.02,36.44 IC4.10
  Bottom 0.406: 75.17,42.05 71.03,37.9 71.03,35.24
  Bottom 0.61: v68.94,35.24 71.03,35.24 v84.51,35.24
SDTI  (via drill 0.6)
  Top 0.305: v12.22,33.97 10.87,33.97 10.15,34.69 10.15,36.59 10.66,37.09 IC1.9
  Top 0.406: v21.98,64.66 41.95,64.66 43.76,62.85 43.76,59.82 U$5.11
  Bottom 0.406: v12.22,33.97 8.07,33.97 3.5,38.86 3.5,59.56 9.55,64.66 v21.98,64.66 21.98,66.25 23.25,67.53 25.8,67.53 29.94,71.35 29.94,77.45 JP_SIGIN.1
SDTO1  (via drill 0.6, 0.6 pad 1.02)
  Top 0.305: IC1.12 18.95,37.1 19.85,36.19 19.85,34.68 19.14,33.97 v16.82,33.97 | v36.52,33.97 34.7,33.97 34.1,34.74 34.1,35.91 35.11,37.09 IC2.9
  Bottom 0.305: 28.02,47.78 26.12,49.37 24.84,49.37 23.57,47.78 23.57,41.73 16.88,35.04 16.88,34.03 v16.82,33.97
  Bottom 0.61: v16.82,33.97 v36.52,33.97
SDTO2  (via drill 0.6)
  Top 0.305: v61,33.97 59.99,33.97 59.24,34.72 59.24,35.88 60.45,37.1 IC3.9 | IC2.12 43.81,37.09 44.91,35.99 44.91,34.85 44.03,33.96 v42.57,33.96 v42.56,33.97
  Bottom 0.406: 52.87,49.06 51.6,50.33 49.69,50.33 48.1,48.73 48.1,42.04 42.36,36.31 42.36,34.17 v42.56,33.97
  Bottom 0.61: v42.56,33.97 v61,33.97
SDTO3  (via drill 0.6)
  Top 0.305: v85.47,33.97 84.41,33.97 83.67,34.7 83.67,35.93 84.84,37.09 IC4.9 | IC3.12 67.3,37.11 68.52,37.11 69.75,35.87 69.75,34.72 69.01,33.97 v67.98,33.97
  Bottom 0.406: 77.71,49.37 76.44,50.64 74.53,50.64 73.26,49.37 73.26,43 67.84,37.59 67.84,34.11 v67.98,33.97
  Bottom 0.61: v67.98,33.97 v85.47,33.97
VCC  (via drill 0.6)
  Top 0.406: IC4.20 93.26,42.3 94.28,43.32 94.28,44.56 | 94.28,44.56 93.46,45.38 C9.1 | 94.28,44.56 94.28,44.59 v95.24,45.55 | v101.29,48.73 101.29,50.65 LED1.A
  Bottom 0.406: v95.24,45.55 99.78,45.55 101.34,47.11 101.34,48.68 v101.29,48.73

### Text on the board
tPlace: DOUT | CLK | +5V | V+ | +5V | GND | +15V | DIN | CIN | PROG | GND | r | b | b | g | 3 | g | r | r | b | CO | b | g | 2 | g | r | DO | 1 | 2 | 3 | 4
tNames: 0 | 1